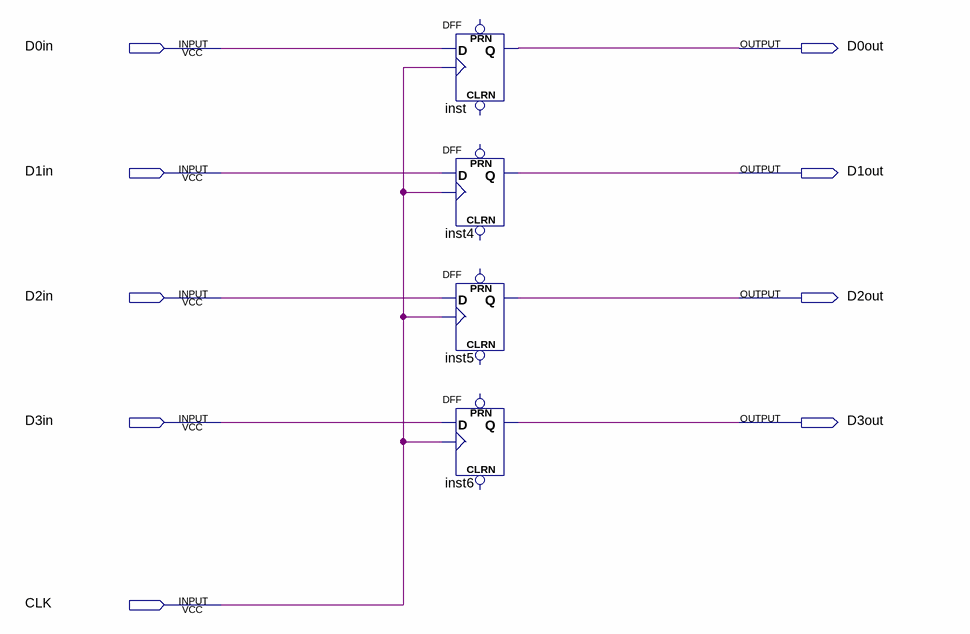
[diagram p0: schematic sheet]
// Quartus schematic registrador.bdf as structural Verilog: 4 symbols, 9 pins
module registrador (
  input  D0in,
  input  D1in,
  input  D2in,
  input  D3in,
  input  CLK,
  output D0out,
  output D1out,
  output D2out,
  output D3out
);

  DFF inst (.CLK(CLK), .D(D0in), .Q(D0out));  // open: CLRN, PRN
  DFF inst4 (.CLK(CLK), .D(D1in), .Q(D1out));  // open: CLRN, PRN
  DFF inst5 (.CLK(CLK), .D(D2in), .Q(D2out));  // open: CLRN, PRN
  DFF inst6 (.CLK(CLK), .D(D3in), .Q(D3out));  // open: CLRN, PRN
endmodule
